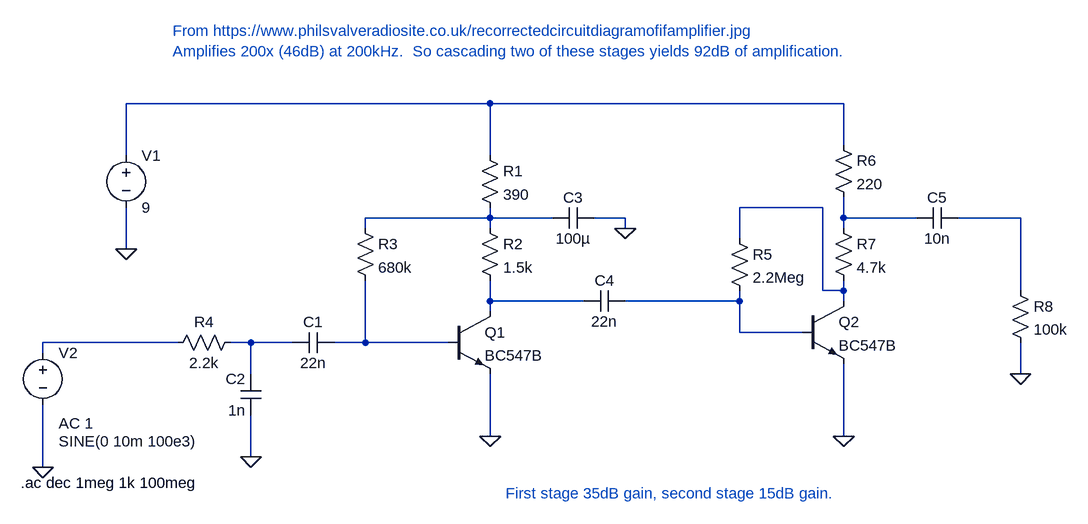
[diagram p0: schematic PhilsValve.asc]
PhilsValve.asc, the LTspice schematic file:
Version 4
SHEET 1 880 680
WIRE -304 -304 -864 -304
WIRE 240 -304 -304 -304
WIRE 240 -240 240 -304
WIRE -864 -224 -864 -304
WIRE -304 -224 -304 -304
WIRE 208 -144 80 -144
WIRE -304 -128 -304 -144
WIRE -304 -128 -496 -128
WIRE -208 -128 -304 -128
WIRE -96 -128 -144 -128
WIRE 240 -128 240 -160
WIRE 352 -128 240 -128
WIRE 512 -128 416 -128
WIRE -496 -112 -496 -128
WIRE -304 -112 -304 -128
WIRE -96 -112 -96 -128
WIRE 240 -112 240 -128
WIRE 80 -96 80 -144
WIRE -864 -80 -864 -144
WIRE 208 -16 208 -144
WIRE 240 -16 240 -32
WIRE 240 -16 208 -16
WIRE 512 -16 512 -128
WIRE -304 0 -304 -32
WIRE -160 0 -304 0
WIRE 80 0 80 -16
WIRE 80 0 -96 0
WIRE 240 0 240 -16
WIRE -304 16 -304 0
WIRE 80 48 80 0
WIRE 176 48 80 48
WIRE -784 64 -992 64
WIRE -672 64 -704 64
WIRE -608 64 -672 64
WIRE -496 64 -496 -32
WIRE -496 64 -544 64
WIRE -368 64 -496 64
WIRE -992 80 -992 64
WIRE -672 112 -672 64
WIRE 512 112 512 64
WIRE -304 208 -304 112
WIRE 240 208 240 96
WIRE -672 240 -672 176
WIRE -992 256 -992 160
FLAG -672 240 0
FLAG -304 208 0
FLAG 240 208 0
FLAG -864 -80 0
FLAG -992 256 0
FLAG -96 -112 0
FLAG 512 112 0
SYMBOL npn -368 16 R0
SYMATTR InstName Q1
SYMATTR Value BC547B
SYMBOL npn 176 0 R0
SYMATTR InstName Q2
SYMATTR Value BC547B
SYMBOL res -320 -240 R0
SYMATTR InstName R1
SYMATTR Value 390
SYMBOL res -320 -128 R0
SYMATTR InstName R2
SYMATTR Value 1.5k
SYMBOL res -512 -128 R0
SYMATTR InstName R3
SYMATTR Value 680k
SYMBOL cap -544 48 R90
WINDOW 0 0 32 VBottom 2
WINDOW 3 32 32 VTop 2
SYMATTR InstName C1
SYMATTR Value 22n
SYMBOL cap -656 176 R180
WINDOW 0 24 56 Left 2
WINDOW 3 24 8 Left 2
SYMATTR InstName C2
SYMATTR Value 1n
SYMBOL res -688 48 R90
WINDOW 0 0 56 VBottom 2
WINDOW 3 32 56 VTop 2
SYMATTR InstName R4
SYMATTR Value 2.2k
SYMBOL cap -144 -144 R90
WINDOW 0 0 32 VBottom 2
WINDOW 3 32 32 VTop 2
SYMATTR InstName C3
SYMATTR Value 100µ
SYMBOL cap -96 -16 R90
WINDOW 0 0 32 VBottom 2
WINDOW 3 32 32 VTop 2
SYMATTR InstName C4
SYMATTR Value 22n
SYMBOL res 64 -112 R0
SYMATTR InstName R5
SYMATTR Value 2.2Meg
SYMBOL res 224 -256 R0
SYMATTR InstName R6
SYMATTR Value 220
SYMBOL res 224 -128 R0
SYMATTR InstName R7
SYMATTR Value 4.7k
SYMBOL cap 416 -144 R90
WINDOW 0 0 32 VBottom 2
WINDOW 3 32 32 VTop 2
SYMATTR InstName C5
SYMATTR Value 10n
SYMBOL voltage -864 -240 R0
SYMATTR InstName V1
SYMATTR Value 9
SYMBOL voltage -992 64 R0
WINDOW 3 24 152 Left 2
WINDOW 123 24 124 Left 2
WINDOW 39 0 0 Left 0
SYMATTR Value SINE(0 10m 100e3)
SYMATTR Value2 AC 1
SYMATTR InstName V2
SYMBOL res 496 -32 R0
SYMATTR InstName R8
SYMATTR Value 100k
TEXT -792 -416 Left 2 ;From https://www.philsvalveradiosite.co.uk/recorrectedcircuitdiagramofifamplifier.jpg\nAmplifies 200x (46dB) at 200kHz.  So cascading two of these stages yields 92dB of amplification.
TEXT -1026 280 Left 2 !.ac dec 1meg 1k 100meg
TEXT -280 296 Left 2 ;First stage 35dB gain, second stage 15dB gain.

The netlist it stands for:
* PhilsValve.asc
Q1 N006 N010 0 0 BC547B
Q2 N002 N007 0 0 BC547B
R1 N001 N003 390
R2 N003 N006 1.5k
R3 N003 N010 680k
C1 N010 N009 22n
C2 0 N009 1n
R4 N009 N008 2.2k
C3 0 N003 100µ
C4 N007 N006 22n
R5 N002 N007 2.2Meg
R6 N001 N004 220
R7 N004 N002 4.7k
C5 N005 N004 10n
V1 N001 0 9
V2 N008 0 SINE(0 10m 100e3) AC 1
R8 N005 0 100k
.model NPN NPN
.model PNP PNP
.lib standard.bjt
* From https://www.philsvalveradiosite.co.uk/recorrectedcircuitdiagramofifamplifier.jpg
* Amplifies 200x (46dB) at 200kHz.  So cascading two of these stages yields 92dB of amplification.
.ac dec 1meg 1k 100meg
* First stage 35dB gain, second stage 15dB gain.
.backanno
.end